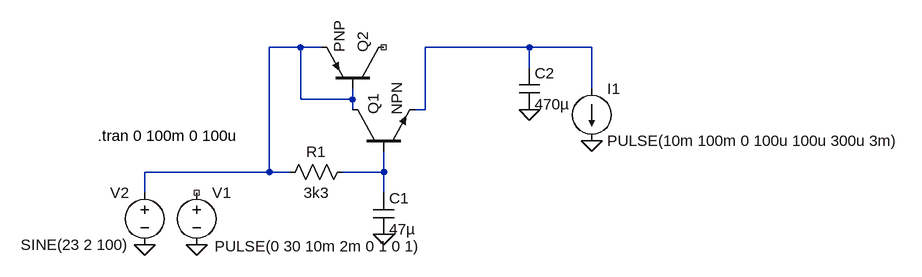
[diagram p0: schematic capacitance_multiplier.asc]
capacitance_multiplier.asc, the LTspice schematic file:
Version 4
SHEET 1 988 680
WIRE 32 0 -16 0
WIRE 64 0 32 0
WIRE 384 0 224 0
WIRE 480 0 384 0
WIRE 384 32 384 0
WIRE 480 64 480 0
WIRE 32 80 32 0
WIRE 112 80 112 64
WIRE 112 80 32 80
WIRE 112 96 112 80
WIRE 224 96 224 0
WIRE 224 96 208 96
WIRE -16 192 -16 0
WIRE -16 192 -208 192
WIRE 16 192 -16 192
WIRE 160 192 160 160
WIRE 160 192 96 192
WIRE -208 224 -208 192
WIRE 160 224 160 192
FLAG 160 288 0
FLAG -128 304 0
FLAG 480 144 0
FLAG 384 96 0
FLAG -208 304 0
SYMBOL npn 112 160 R270
SYMATTR InstName Q1
SYMBOL res 112 176 R90
WINDOW 0 0 56 VBottom 2
WINDOW 3 32 56 VTop 2
SYMATTR InstName R1
SYMATTR Value 3k3
SYMBOL cap 144 224 R0
SYMATTR InstName C1
SYMATTR Value 47µ
SYMBOL voltage -128 208 R0
WINDOW 3 28 98 Left 2
WINDOW 123 24 124 Left 2
WINDOW 39 24 152 Left 2
SYMATTR Value PULSE(0 30 10m 2m 0 1 0 1)
SYMATTR InstName V1
SYMBOL current 480 64 R0
WINDOW 123 0 0 Left 0
WINDOW 39 0 0 Left 0
SYMATTR InstName I1
SYMATTR Value PULSE(10m 100m 0 100u 100u 300u 3m)
SYMBOL cap 368 32 R0
SYMATTR InstName C2
SYMATTR Value 470µ
SYMBOL voltage -208 208 M0
WINDOW 123 0 0 Left 0
WINDOW 39 0 0 Left 0
SYMATTR InstName V2
SYMATTR Value SINE(23 2 100)
SYMBOL pnp 160 64 M270
SYMATTR InstName Q2
TEXT -280 136 Left 2 !.tran 0 100m 0 100u

The netlist it stands for:
* capacitance_multiplier.asc
Q1 N001 N003 N002 0 NPN
R1 N003 N001 3k3
C1 N003 0 47µ
V1 NC_01 0 PULSE(0 30 10m 2m 0 1 0 1)
I1 N002 0 PULSE(10m 100m 0 100u 100u 300u 3m)
C2 N002 0 470µ
V2 N001 0 SINE(23 2 100)
Q2 NC_02 N001 N001 0 PNP
.model NPN NPN
.model PNP PNP
.lib standard.bjt
.tran 0 100m 0 100u
.backanno
.end